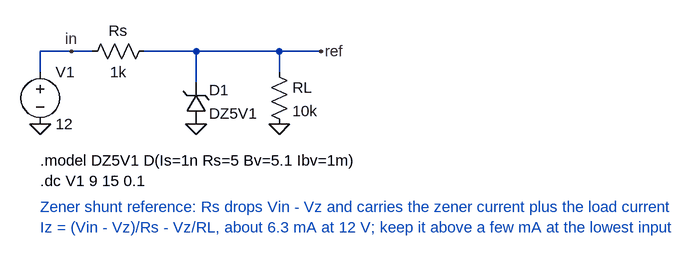
[diagram p0: schematic zener_reference.asc]
zener_reference.asc, the LTspice schematic file:
Version 4
SHEET 1 880 680
WIRE 32 112 32 144
WIRE 112 112 32 112
WIRE 272 112 192 112
WIRE 400 112 272 112
WIRE 464 112 400 112
WIRE 272 160 272 112
WIRE 400 144 400 112
FLAG 32 224 0
FLAG 272 224 0
FLAG 400 224 0
FLAG 80 112 in
FLAG 464 112 ref
SYMBOL voltage 32 128 R0
SYMATTR InstName V1
SYMATTR Value 12
SYMBOL res 208 96 R90
WINDOW 0 0 56 VBottom 2
WINDOW 3 32 56 VTop 2
SYMATTR InstName Rs
SYMATTR Value 1k
SYMBOL zener 256 224 M180
WINDOW 0 36 52 Left 2
WINDOW 3 36 16 Left 2
SYMATTR InstName D1
SYMATTR Value DZ5V1
SYMBOL res 384 128 R0
SYMATTR InstName RL
SYMATTR Value 10k
TEXT 32 280 Left 2 !.model DZ5V1 D(Is=1n Rs=5 Bv=5.1 Ibv=1m)
TEXT 32 312 Left 2 !.dc V1 9 15 0.1
TEXT 32 352 Left 2 ;Zener shunt reference: Rs drops Vin - Vz and carries the zener current plus the load current\nIz = (Vin - Vz)/Rs - Vz/RL, about 6.3 mA at 12 V; keep it above a few mA at the lowest input

The netlist it stands for:
* zener_reference.asc
V1 in 0 12
Rs ref in 1k
D1 0 ref DZ5V1
RL ref 0 10k
.model D D
.lib standard.dio
.model DZ5V1 D(Is=1n Rs=5 Bv=5.1 Ibv=1m)
.dc V1 9 15 0.1
* Zener shunt reference: Rs drops Vin - Vz and carries the zener current plus the load current
* Iz = (Vin - Vz)/Rs - Vz/RL, about 6.3 mA at 12 V; keep it above a few mA at the lowest input
.backanno
.end